# Altium schematic sheet ELN1project.SchDoc
size A4; DrawnBy: J. Nanchen & T. Jozipovic; Revision: V1
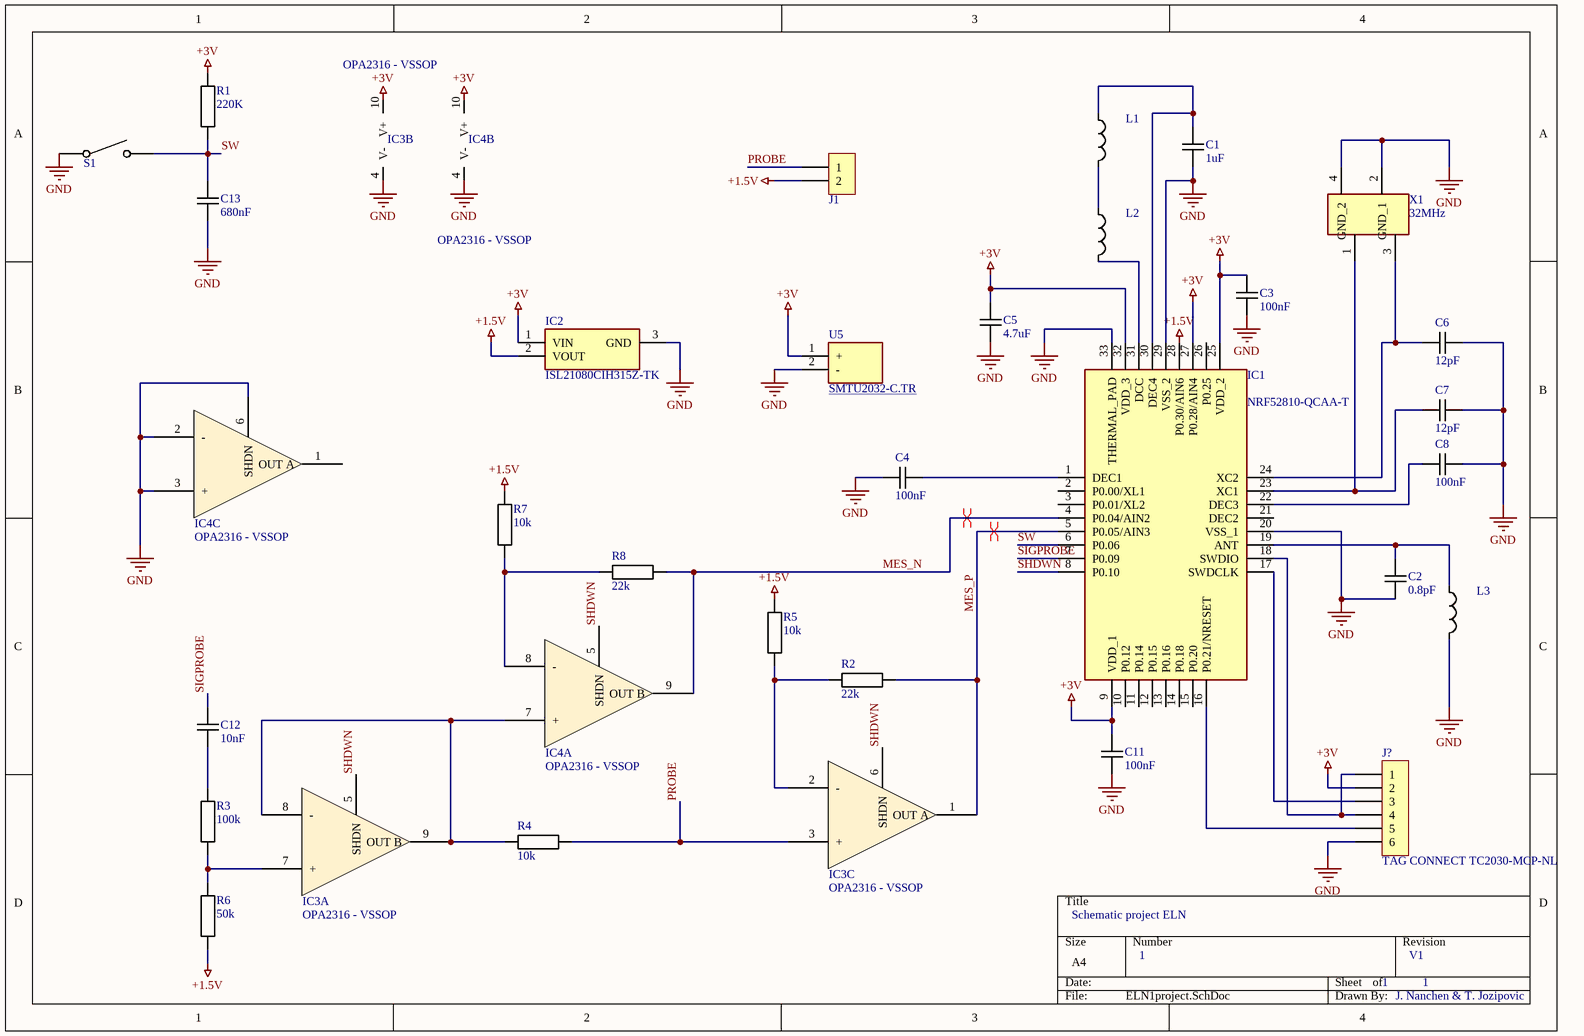
[diagram p0: ELN1project.SchDoc]

## Parts
C1  1uF  [CAPACITOR 1608 REFLOW]
C2  0.8pF  [CAPACITOR 1608 REFLOW]
C3  100nF  [CAPACITOR 1005 REFLOW]
C4  100nF  [CAPACITOR 1005 REFLOW]
C5  4.7uF  [CAPACITOR 1608 REFLOW]
C6  12pF  [CAPACITOR 1005 REFLOW]
C7  12pF  [CAPACITOR 1005 REFLOW]
C8  100nF  [CAPACITOR 1005 REFLOW]
C11  100nF  [CAPACITOR 1005 REFLOW]
C12  10nF  [CAPACITOR 1005 REFLOW]
C13  680nF  [CAPACITOR 1005 REFLOW]
IC1  NRF52810-QCAA-T  [QFN50P500X500X80-33N]
IC2  ISL21080CIH315Z-TK  [SOT95P237X112-3N]
IC3  OPA2316 - VSSOP  [OPA2316 - VSSOP]  (parts A,B,C of 3)
IC4  OPA2316 - VSSOP  [OPA2316 - VSSOP]  (parts A,B,C of 3)
J1  *  [PinHeader1x2 P1.27]  (value not drawn)
J?  TAG CONNECT TC2030-MCP-NL  [TAG CONNECT TC2030-MCP-NL]
L1  15nH  [INDUCTOR 1608 REFLOW]  (value not drawn)
L2  10uH  [INDUCTOR 2012 REFLOW]  (value not drawn)
L3  3.9nH  [INDUCTOR 2012 REFLOW]  (value not drawn)
R1  220K  [RESISTOR 1005 REFLOW]
R2  22k  [RESISTOR 1005 REFLOW]
R3  100k  [RESISTOR 1005 REFLOW]
R4  10k  [RESISTOR 1005 REFLOW]
R5  10k  [RESISTOR 1005 REFLOW]
R6  50k  [RESISTOR 1005 REFLOW]
R7  10k  [RESISTOR 1005 REFLOW]
R8  22k  [RESISTOR 1005 REFLOW]
S1  *  [Push Switch Panasonic EVQ-P7J01P]  (value not drawn)
U5  SMTU2032-C.TR  [SMTU2032CTR]
X1  32MHz  [FA20H160000MF12ZAC3]

## Nets
+1.5V: IC1.28(P0.30/AIN6) IC2.2(VOUT) J1.2 R5.1 R6.1 R7.1
+3V: C3.2 C5.2 C11.2 IC1.9(VDD_1) IC1.25(VDD_2) IC1.27(P0.28/AIN4) IC1.32(VDD_3) IC2.1(VIN) IC3.10(V+) IC4.10(V+) J?.2 R1.2 U5.1(+)
GND: C1.1 C2.1 C3.1 C4.1 C5.1 C6.2 C7.2 C8.2 C11.1 C13.1 IC1.20(VSS_1) IC1.29(VSS_2) IC1.33(THERMAL_PAD) IC2.3(GND) IC3.4(V-) IC4.2(-) IC4.3(+) IC4.4(V-) IC4.6(SHDN) J?.6 L3.2 S1.1 U5.2(-) X1.2(GND_1) X1.4(GND_2)
MES_N: IC1.4(P0.04/AIN2) IC4.9(OUT_B) R8.1
MES_P: IC1.5(P0.05/AIN3) IC3.1(OUT_A) R2.1
PROBE: IC3.3(+) J1.1 R4.1
SHDWN: IC1.8(P0.10) IC3.5(SHDN) IC3.6(SHDN) IC4.5(SHDN)
SIGPROBE: C12.2 IC1.7(P0.09)
SW: C13.2 IC1.6(P0.06) R1.1 S1.2
NetC1_2: C1.2 IC1.30(DEC4) L1.1
NetC2_2: C2.2 IC1.19(ANT) L3.1
NetC4_2: C4.2 IC1.1(DEC1)
NetC6_1: C6.1 IC1.24(XC2) X1.3(CRYSTAL_2)
NetC7_1: C7.1 IC1.23(XC1) X1.1(CRYSTAL_1)
NetC8_1: C8.1 IC1.22(DEC3)
NetC12_1: C12.1 R3.2
NetIC1_16: IC1.16(P0.21/NRESET) J?.5
NetIC1_17: IC1.17(SWDCLK) J?.3
NetIC1_18: IC1.18(SWDIO) J?.1 J?.4
NetIC1_31: IC1.31(DCC) L2.2
NetIC3_2: IC3.2(-) R2.2 R5.2
NetIC3_7: IC3.7(+) R3.1 R6.2
NetIC3_8: IC3.8(-) IC3.9(OUT_B) IC4.7(+) R4.2
NetIC4_8: IC4.8(-) R7.2 R8.2
NetL1_2: L1.2 L2.1

Not connected (* = marked no-connect by the designer): IC1 2(P0.00/XL1) 3(P0.01/XL2) 10(P0.12) 11(P0.14) 12(P0.15) 13(P0.16) 14(P0.18) 15(P0.20) 21(DEC2) 26(P0.25); IC4 1(OUT_A)

## Layout directives
differential pair: MES_N, MES_P

## Notes on the sheet
- Schematic project ELN
- 1
- V1
- J. Nanchen & T. Jozipovic

## Library data of the parts
C1-C8 C11-C13 = Capacitor
  C1: Value: 1uF
  C2: Value: 0.8pF
  C3 C4 C8 C11: Value: 100nF
  C5: Value: 4.7uF
  C6 C7: Value: 12pF
  C12: Value: 10nF
  C13: Value: 680nF
IC1 = NRF52810-QCAA-T: Integrated Circuit; Manufacturer_Name: Nordic Semiconductor; Datasheet Link: https://componentsearchengine.com/Datasheets/1/nRF52810-QCAA-T.pdf; Height: 0.8mm; Manufacturer_Part_Number: NRF52810-QCAA-T; Mouser Part Number: 949-NRF52810-QCAA-T; Mouser Price/Stock: https://www.mouser.co.uk/ProductDetail/Nordic-Semiconductor/nRF52810-QCAA-T?qs=5aG0NVq1C4ykfpvypn%2FnAA%3D%3D; RS Part Number: 1697120P; RS Price/Stock: http://uk.rs-online.com/web/p/products/1697120P
IC2 = ISL21080CIH315Z-TK: Integrated Circuit; Manufacturer_Name: Renesas Electronics; Datasheet Link: https://www.renesas.com/en-us/www/doc/datasheet/isl21080.pdf; Height: 1.12mm; Manufacturer_Part_Number: ISL21080CIH315Z-TK; Mouser Part Number: 968-ISL21080CIH315ZT; Mouser Price/Stock: http://www.mouser.com/Search/ProductDetail.aspx?qs=9fLuogzTs8LxZWNzls3EKw%3d%3d
J1 = PinHeader1x2: Plug connector; Value: *
L1-L3 = Inductor
  L1: Value: 15nH
  L2: Value: 10uH
  L3: Value: 3.9nH
R1-R8 = Resistor
  R1: Value: 220K
  R2 R8: Value: 22k
  R3: Value: 100k
  R4 R5 R7: Value: 10k
  R6: Value: 50k
S1 = Push Switch, 4 pins, SPST-NO: Push Switch, 4 pins; Value: *
U5 = SMTU2032-C.TR: Undefined or Miscellaneous; Manufacturer_Name: RENATA; Datasheet Link: https://componentsearchengine.com/Datasheets/1/SMTU2032-C.TR.pdf; Height: 5.6mm; Manufacturer_Part_Number: SMTU2032-C.TR; Mouser Part Number: 614-SMTU2032-C.TR; Mouser Price/Stock: https://www.mouser.co.uk/ProductDetail/Renata/SMTU2032-CTR?qs=UxeAxwACbqlbJ4Hul%252BCKVg%3D%3D
X1 = FA-20H_32.0000MF20X-K5: Crystal or Oscillator; Manufacturer_Name: Epson Timing; Manufacturer_Part_Number: FA-20H 32.0000MF20X-K5; Datasheet Link: https://support.epson.biz/td/api/doc_check.php?dl=brief_FA-20H&lang=en; Height: 0.55mm; Mouser Part Number: 732-FA-20H32MF20X-K5; Mouser Price/Stock: https://www.mouser.co.uk/ProductDetail/Epson-Timing/FA-20H-320000MF20X-K5?qs=f9yNj16SXrLwvA3JhG%252BQFg%3D%3D